# Altium project VR_Controller.PrjPcb
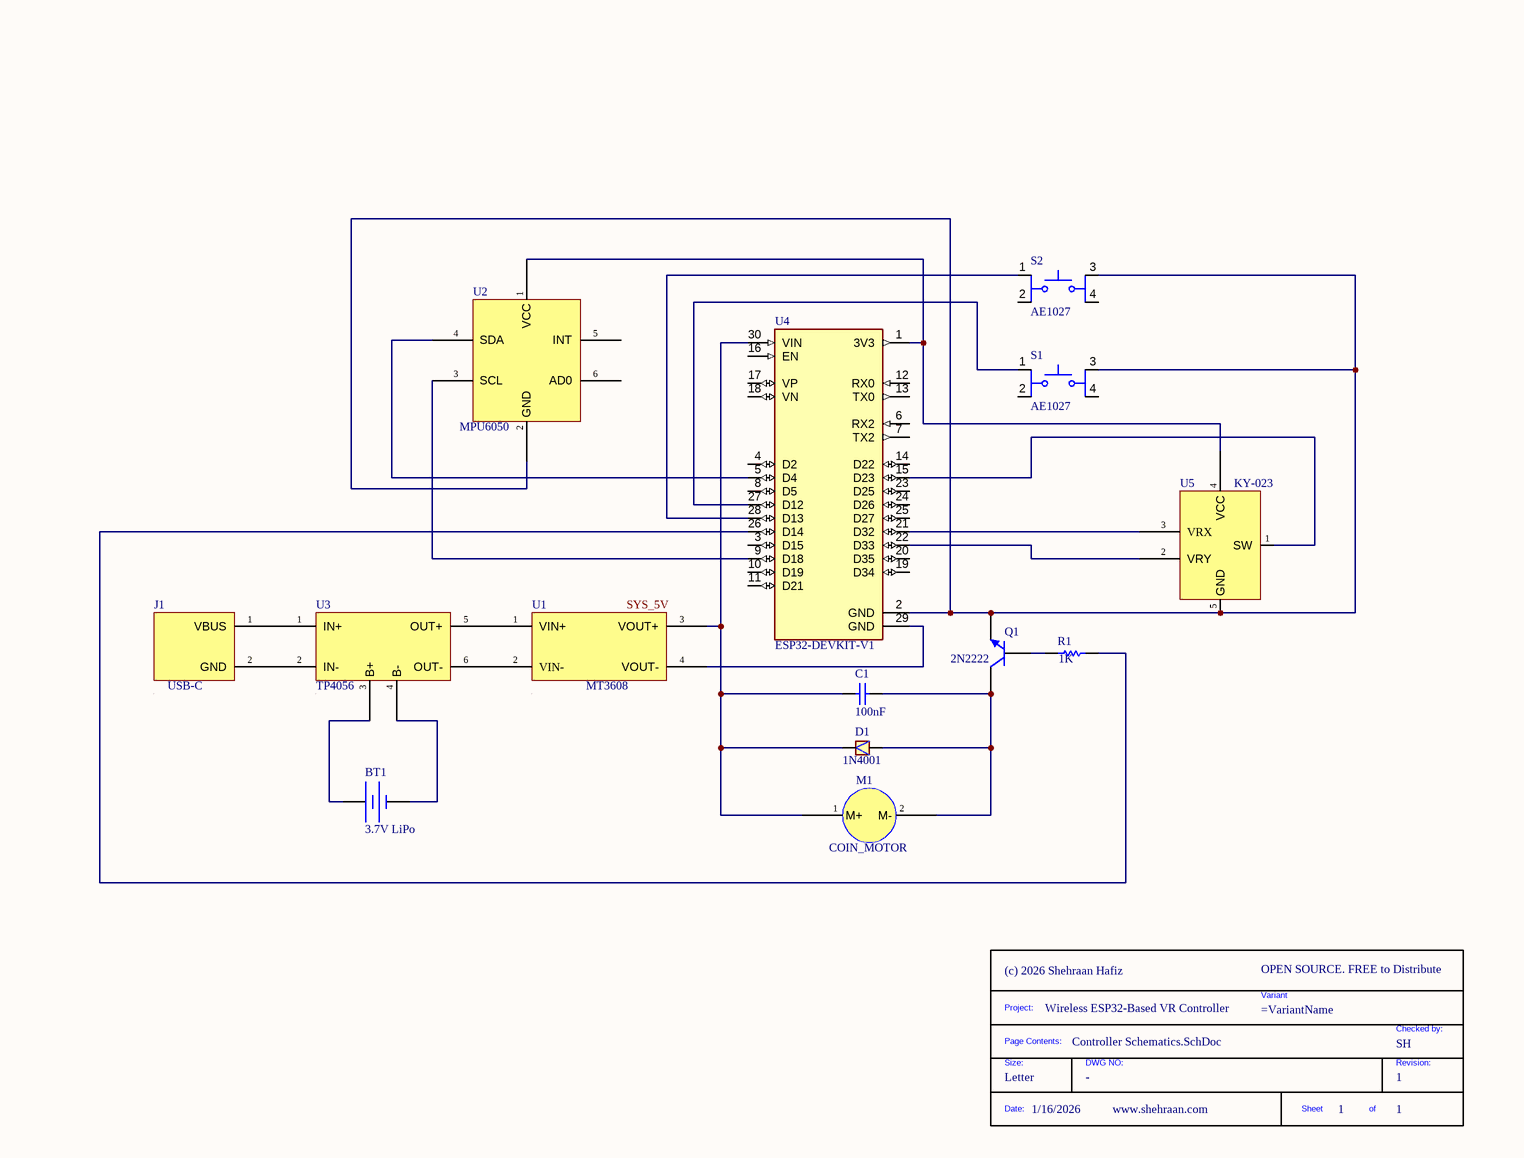
[diagram p0: Controller Schematics.SchDoc]
Company: (c) 2026 Shehraan Hafiz; DesignedByURL: www.shehraan.com; Project: Wireless ESP32-Based VR Controller; VersionRevision: 1
1 sheet, 15 parts. Net scope: global (net labels, ports and power ports of the same name join across sheets).

## Sheet Controller Schematics.SchDoc: VR
size Letter; Date: 1/16/2026; DocumentNumber: VR; Revision: VR; SheetNumber: 1; SheetTotal: 1

### Parts
*  Size: Letter  Checked By: SH  (hidden comment: TITLE_BLOCK)  (graphical)
BT1  103450 LiPo: 3.7V LiPo  (hidden comment: Constant Voltage Source)
C1  value 100nF  (hidden comment: Capacitor)
D1  1N4001  [DO41-10]
J1  USB-C
M1  COIN_MOTOR
Q1  Bipolar NPN 3 Pins Transistor Modified Version of the Gummel-Poon Model  (value not drawn)
R1  value 1K  (hidden comment: Resistor)
S1  AE1027  [SW_TL3305BF260QG]
S2  AE1027  [SW_TL3305BF260QG]
U1  MT3608
U2  MPU6050
U3  TP4056
U4  ESP32-DEVKIT-V1  [MODULE_ESP32_DEVKIT_V1]
U5  KY-023

### Nets
NetBT1_1: BT1.1 U3.3(B+)
NetBT1_2: BT1.2 U3.4(B-)
NetC1_1: C1.1 D1.C(CATHODE) M1.1(M+) U1.3(VOUT+) U4.30(VIN)
NetC1_2: C1.2 D1.A(ANODE) M1.2(M-) Q1.1(C)
NetJ1_1: J1.1(VBUS) U3.1(IN+)
NetJ1_2: J1.2(GND) U3.2(IN-)
NetQ1_2: Q1.2(B) R1.1
NetQ1_3: Q1.3(E) S1.3 S2.3 U2.2(GND) U4.2(GND) U5.5(GND)
NetR1_2: R1.2 U4.26(D14)
NetS1_1: S1.1 U4.27(D12)
NetS2_1: S2.1 U4.28(D13)
NetU1_1: U1.1(VIN+) U3.5(OUT+)
NetU1_2: U1.2(VIN-) U3.6(OUT-)
NetU1_4: U1.4(VOUT-) U4.29(GND)
NetU2_1: U2.1(VCC) U4.1(3V3) U5.4(VCC)
NetU2_3: U2.3(SCL) U4.9(D18)
NetU2_4: U2.4(SDA) U4.5(D4)
NetU4_15: U4.15(D23) U5.1(SW)
NetU4_21: U4.21(D32) U5.3(VRX)
NetU4_22: U4.22(D33) U5.2(VRY)

Not connected (* = marked no-connect by the designer): S1 2 4; S2 2 4; U2 5(INT) 6(AD0); U4 3(D15) 4(D2) 6(RX2) 7(TX2) 8(D5) 10(D19) 11(D21) 12(RX0) 13(TX0) 14(D22) 16(EN) 17(VP) 18(VN) 19(D34) 20(D35) 23(D25) 24(D26) 25(D27)

### Notes on the sheet
- (near Q1) 2N2222
- Labels drawn without touching a wire or pin: SYS_5V
- DWG. NO.
- REV.
- SHT.
- THIS DOCUMENT AND THE DATA DISCLOSED HEREIN OR HEREWITH IS THE PROPERTY OF ALTIUM LIMITED AND MAY BE FREELY DISTRIBUTED IN WHOLE. NO RIGHTS ARE RESERVED OR EXPRESS OR IMPLIED WARANTEE GIVEN.
- REVISION
- DESCRIPTION
- DATE
- APPROVED
- ENG:
- APPROVALS
- PROJECT
- DSN:
- CHK:
- REFERENCE DOCUMENTS
- PROJECT REVISION:
- TITLE
- DOCUMENT REVISION:
- DESIGN ITEM:
- BOM:
- FAB DWG:
- PCB DWG:
- ASSY DWG:
- SCALE:
- SIZE
- B
- CAGE CODE
- FILE NAME
- DWG NO.
- SHEET
- OF
- REV
- (in symbol TITLE_BLOCK) OPEN SOURCE. FREE to Distribute; Project:; Variant; Checked by:; Page Contents:; Size:; DWG NO:; Revision:; Date:; Sheet; of

### Library data of the parts
* = TITLE_BLOCK: Standard Title Block; DWG NO: -
BT1 = Battery: SimulationGenericComponent: True
C1 = Capacitor: SimulationGenericComponent: True
D1 = 1N4001: Diode Standard 50V 1A Through Hole DO-204AL (DO-41); MF: ON Semiconductor; SnapEDA_Link: https://www.snapeda.com/parts/1N4001/Onsemi/view-part/?ref=snap; Package: DO-41 onsemi; Value: *; MP: 1N4001; Check_prices: https://www.snapeda.com/parts/1N4001/Onsemi/view-part/?ref=eda
Q1 = BJT NPN_MGP: BF: 100; AF: 0; BR: 1; EG: 1.11; FC: 0.5; IS: 1e-16; MJC: 0.33; NC: 2; NE: 1.5; TNOM: 27; VBC_MAX: 1e99; VJC: 0.75; XTI: 3; SimulationGenericComponent: True; CJC: 0; CJE: 0; CJS: 0; CTC: 0; CTE: 0; CTS: 0; IKF: 0; IKR: 0; IRB: 0; ISC: 0; ISE: 0; ISS: 0; ITF: 0; KF: 0; MJE: 0.33; MJS: 0; NF: 1; NKF: 0.5; NR: 1; NS: 1; PTF: 0; RB: 0; RBM: 0; RC: 0; RE: 0; SUBS: 1; TBF1: 0; TBF2: 0; TBR1: 0; TBR2: 0; TF: 0; TIKF1: 0; TIKF2: 0; TIKR1: 0; TIKR2: 0; TIRB1: 0; TIRB2: 0; TIS1: 0; TIS2: 0; TISC1: 0; TISC2: 0; TISE1: 0; TISE2: 0; TITF1: 0; TITF2: 0; TLEV: 0; TLEVC: 0; TMJC1: 0; TMJC2: 0; TMJE1: 0; TMJE2: 0; TMJS1: 0; TMJS2: 0; TNC1: 0; TNC2: 0; TNE1: 0; TNE2: 0; TNF1: 0; TNF2: 0; TNR1: 0; TNR2: 0; TNS1: 0; TNS2: 0; TR: 0; TRB1: 0; TRB2: 0; TRC1: 0; TRC2: 0; TRE1: 0; TRE2: 0; TRM1: 0; TRM2: 0; TTF1: 0; TTF2: 0; TTR1: 0; TTR2: 0; TVAF1: 0; TVAF2: 0; TVAR1: 0; TVAR2: 0; TVJC: 0; TVJE: 0; TVJS: 0; VAF: 0; VAR: 0; VBE_MAX: 1e99; VCE_MAX: 1e99; VJE: 0.75; VJS: 0.75; VTF: 0; XCJC: 1; XTB: 0; XTF: 0
R1 = Resistor: TC1: 0; SimulationGenericComponent: True; TC2: 0
S1 S2 = TL3305BF260QG: Tactile Switch SPST-NO Top Actuated Surface Mount; MF: E-Switch; SnapEDA_Link: https://www.snapeda.com/parts/TL3305BF260QG/E-Switch/view-part/?ref=snap; Package: None; Value: *; MP: TL3305BF260QG; Check_prices: https://www.snapeda.com/parts/TL3305BF260QG/E-Switch/view-part/?ref=eda
U4 = ESP32-DEVKIT-V1: Dual core, Wi-Fi: 2.4 GHz up to 150 Mbits/s,BLE (Bluetooth Low Energy) and legacy Bluetooth, 32 bits, Up to 240 MHz; MF: Do it; SnapEDA_Link: https://www.snapeda.com/parts/ESP32-DEVKIT-V1/Do+it/view-part/?ref=snap; Package: None; Value: *; MP: ESP32-DEVKIT-V1; Check_prices: https://www.snapeda.com/parts/ESP32-DEVKIT-V1/Do+it/view-part/?ref=eda